# Altium schematic sheet voltage_mode_preamplifier.SchDoc
size A
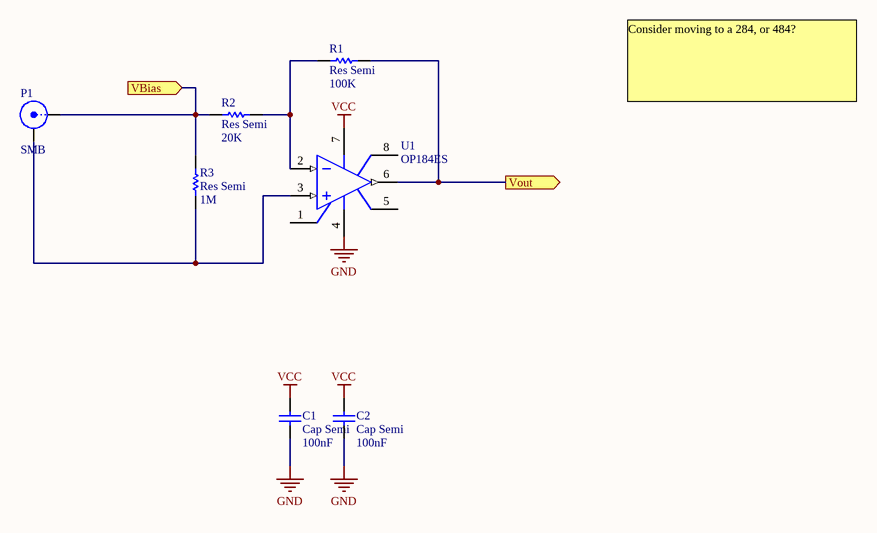
[diagram p0: voltage_mode_preamplifier.SchDoc]

## Parts
C1  Cap Semi  value 100nF  [C0805]
C2  Cap Semi  value 100nF  [C0805]
P1  SMB  [SMB_V-RJ45]
R1  Res Semi  value 100K  [RESC2012L]
R2  Res Semi  value 20K  [RESC2012L]
R3  Res Semi  value 1M  [RESC2012L]
U1  OP184ES  [SO-8_N]

## Ports
VBias (in), Vout (out)

## Nets
GND: C1.1 C2.1 U1.4(V-)
VCC: C1.2 C2.2 U1.7(V+)
VBias: P1.1(X) R2.1 R3.2 ; port VBias
Vout: R1.2 U1.6(OUT) ; port Vout
NetP1_2: P1.2(Y) R3.1 U1.3(IN+)
NetR1_1: R1.1 R2.2 U1.2(IN-)

Not connected (* = marked no-connect by the designer): U1 1(NUL) 5(NUL) 8(NC)

## Notes on the sheet
- Consider moving to a 284, or 484?

## Library data of the parts
C1 C2 = Cap Semi: Capacitor (Semiconductor SIM Model); Published: 8-Jun-2000; LatestRevisionDate: 29-May-2009; LatestRevisionNote: IPC-7351 Footprint Added.; PackageReference: C1206; Publisher: Altium Limited; PackageDescription: Chip Capacitor
P1 = SMB: SMB Straight Connector; LatestRevisionDate: 17-Jul-2002; LatestRevisionNote: Re-released for DXP Platform.; Publisher: Altium Limited
R1-R3 = Res Semi: Semiconductor Resistor; Published: 8-Jun-2000; LatestRevisionDate: 17-Jul-2002; LatestRevisionNote: Re-released for DXP Platform.; PackageReference: AXIAL-0.5; Publisher: Altium Limited
U1 = OP184ES: Precision Rail-to-Rail Input and Ouput Operational Amplifier; Note: Pin 8 is not connected.; Published: 8-Jun-2000; LatestRevisionDate: 13-Apr-2006; LatestRevisionNote: IPC-7351 Footprint Added.; DatasheetVersion: REV. 0 1996; PackageVersion: revA; PackageReference: SO-8; Publisher: Altium Limited; PackageDescription: 8-Pin Small Outline Integrated Circuit 1.27 mm Pitch; Code_JEDEC: MS-012-AA; Code_IPC: SOIC127P600-8; ComponentLink1Description: Manufacturer Link; ComponentLink1URL: http://www.analog.com/en/prod/0,,759_786_OP184%2C00.html; ComponentLink2Description: Datasheet; ComponentLink2URL: http://www.analog.com/UploadedFiles/Data_Sheets/390492658OP184_284_484_b.pdf; Digikey PN: OP184FSZ-REEL7CT-ND